# Altium schematic sheet devBoard.SchDoc
size A4
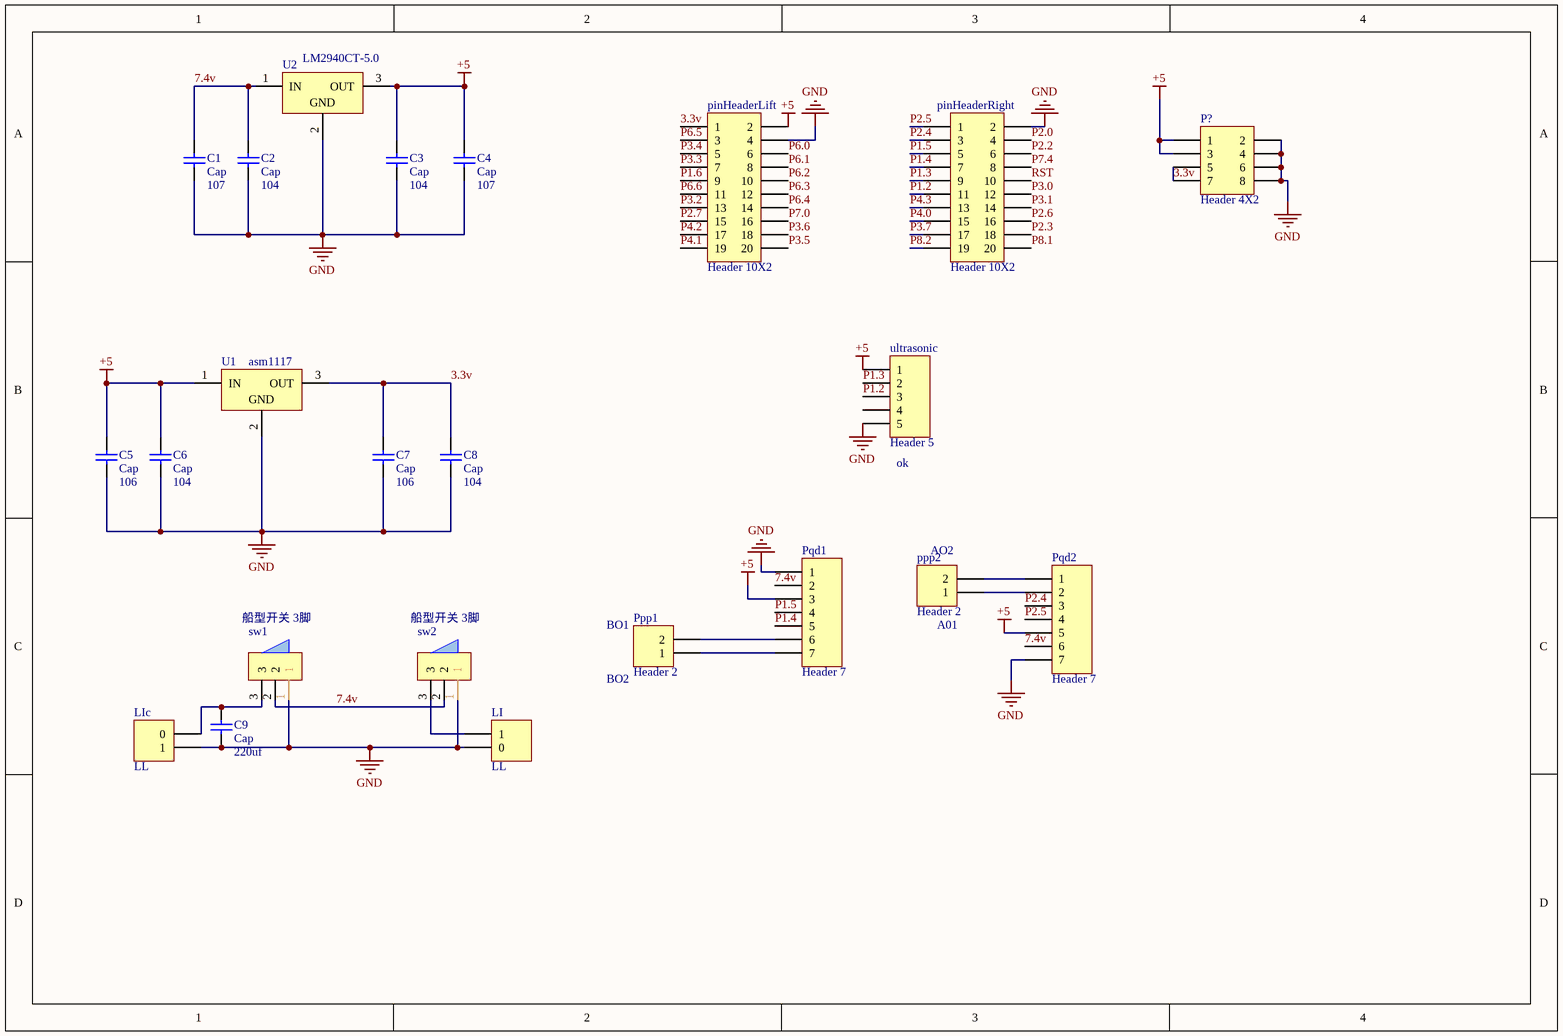
[diagram p0: devBoard.SchDoc]

## Parts
C1  Cap  value 107  [RAD-0.3]
C2  Cap  value 104  [RAD-0.3]
C3  Cap  value 104  [RAD-0.3]
C4  Cap  value 107  [RAD-0.3]
C5  Cap  value 106  [RAD-0.3]
C6  Cap  value 104  [RAD-0.3]
C7  Cap  value 106  [RAD-0.3]
C8  Cap  value 104  [RAD-0.3]
C9  Cap  value 220uf  [RAD-0.3]
LI  LL  [Con 2接线端子]
LIc  LL  [Con 2接线端子]
P?  Header 4X2  [HDR2X4]
pinHeaderLift  Header 10X2  [HDR2X10]
pinHeaderRight  Header 10X2  [HDR2X10]
Ppp1  Header 2  [HDR1X2]
ppp2  Header 2  [HDR1X2]
Pqd1  Header 7  [HDR1X7]
Pqd2  Header 7  [HDR1X7]
sw1  船型开关 3脚  [船型开关 3脚]
sw2  船型开关 3脚  [船型开关 3脚]
U1  asm1117  [T03B]
U2  LM2940CT-5.0  [T03B]
ultrasonic  Header 5  [HDR1X5]

## Nets
+5: C3.2 C4.2 C5.2 C6.2 P?.1 P?.3 pinHeaderLift.2 Pqd1.3 Pqd2.5 U1.1(IN) U2.3(OUT) ultrasonic.1
GND: C1.1 C2.1 C3.1 C4.1 C5.1 C6.1 C7.1 C8.1 C9.1 LI.0 LIc.1 P?.2 P?.4 P?.6 P?.8 pinHeaderLift.4 pinHeaderRight.2 Pqd1.1 Pqd2.7 sw1.1 sw2.1 U1.2(GND) U2.2(GND) ultrasonic.5
3.3v: C7.2 C8.2 P?.5 P?.7 pinHeaderLift.1 U1.3(OUT)
7.4v: C1.2 C2.2 Pqd1.2 Pqd2.6 sw1.2 sw2.2 U2.1(IN)
P1.2: pinHeaderRight.11 ultrasonic.3
P1.3: pinHeaderRight.9 ultrasonic.2
P1.4: pinHeaderRight.7 Pqd1.5
P1.5: pinHeaderRight.5 Pqd1.4
P1.6: pinHeaderLift.9
P2.0: pinHeaderRight.4
P2.2: pinHeaderRight.6
P2.3: pinHeaderRight.18
P2.4: pinHeaderRight.3 Pqd2.3
P2.5: pinHeaderRight.1 Pqd2.4
P2.6: pinHeaderRight.16
P2.7: pinHeaderLift.15
P3.0: pinHeaderRight.12
P3.1: pinHeaderRight.14
P3.2: pinHeaderLift.13
P3.3: pinHeaderLift.7
P3.4: pinHeaderLift.5
P3.5: pinHeaderLift.20
P3.6: pinHeaderLift.18
P3.7: pinHeaderRight.17
P4.0: pinHeaderRight.15
P4.1: pinHeaderLift.19
P4.2: pinHeaderLift.17
P4.3: pinHeaderRight.13
P6.0: pinHeaderLift.6
P6.1: pinHeaderLift.8
P6.2: pinHeaderLift.10
P6.3: pinHeaderLift.12
P6.4: pinHeaderLift.14
P6.5: pinHeaderLift.3
P6.6: pinHeaderLift.11
P7.0: pinHeaderLift.16
P7.4: pinHeaderRight.8
P8.1: pinHeaderRight.20
P8.2: pinHeaderRight.19
RST: pinHeaderRight.10
NetC9_2: C9.2 LIc.0 sw1.3
NetLI_1: LI.1 sw2.3
NetPpp1_1: Ppp1.1 Pqd1.7
NetPpp1_2: Ppp1.2 Pqd1.6
Netppp2_1: ppp2.1 Pqd2.2
Netppp2_2: ppp2.2 Pqd2.1

Not connected (* = marked no-connect by the designer): ultrasonic 4

## Notes on the sheet
- (near ultrasonic) ok
- (near ppp2) AO2
- (near Ppp1) BO1
- (near ppp2) A01
- (near Ppp1) BO2

## Library data of the parts
C1-C9 = Cap: Capacitor; Published: 8-Jun-2000; LatestRevisionDate: 17-Jul-2002; LatestRevisionNote: Re-released for DXP Platform.; PackageReference: RAD-0.3; Publisher: Altium Limited; PackageDescription: Radial Cap, Thru-Hole; 2 Leads; 0.3 in Pin Spacing
LI LIc Ppp1 ppp2 = Header 2: Header, 2-Pin; LatestRevisionDate: 17-Jul-2002; LatestRevisionNote: Re-released for DXP Platform.; Publisher: Altium Limited
P? = Header 4X2: Header, 4-Pin, Dual row; LatestRevisionDate: 17-Jul-2002; LatestRevisionNote: Re-released for DXP Platform.; Publisher: Altium Limited
pinHeaderLift pinHeaderRight = Header 10X2: Header, 10-Pin, Dual row; LatestRevisionDate: 17-Jul-2002; LatestRevisionNote: Re-released for DXP Platform.; Publisher: Altium Limited
Pqd1 Pqd2 = Header 7: Header, 7-Pin; LatestRevisionDate: 17-Jul-2002; LatestRevisionNote: Re-released for DXP Platform.; Publisher: Altium Limited
U1 U2 = LM2940CT-5.0: 1A 5V; Note: Tab is connected to GND; Published: 15-Apr-2002; DatasheetVersion: Jun-1999; PackageVersion: 1995; PackageReference: T03B; Publisher: Altium Limited; PackageDescription: TO, Thru-Hole, Vertical, Heatsink Mounted; 3 In-Line Leads; Pitch 2.54 mm; ComponentLink1Description: Manufacturer Link; ComponentLink1URL: http://www.national.com/; ComponentLink2Description: Datasheet; ComponentLink2URL: http://www.national.com/ds.cgi/LM/LM2940.pdf; ComponentLink3Description: URL Link1; ComponentLink3URL: http://www.national.com/pf/LM/LM2940C.html
ultrasonic = Header 5: Header, 5-Pin; LatestRevisionDate: 17-Jul-2002; LatestRevisionNote: Re-released for DXP Platform.; Publisher: Altium Limited